# EAGLE design ASD2116 (EAGLE 6.3)
DATABASE: ./../../../../../Components/TinyCircuits_Part_Database.txt
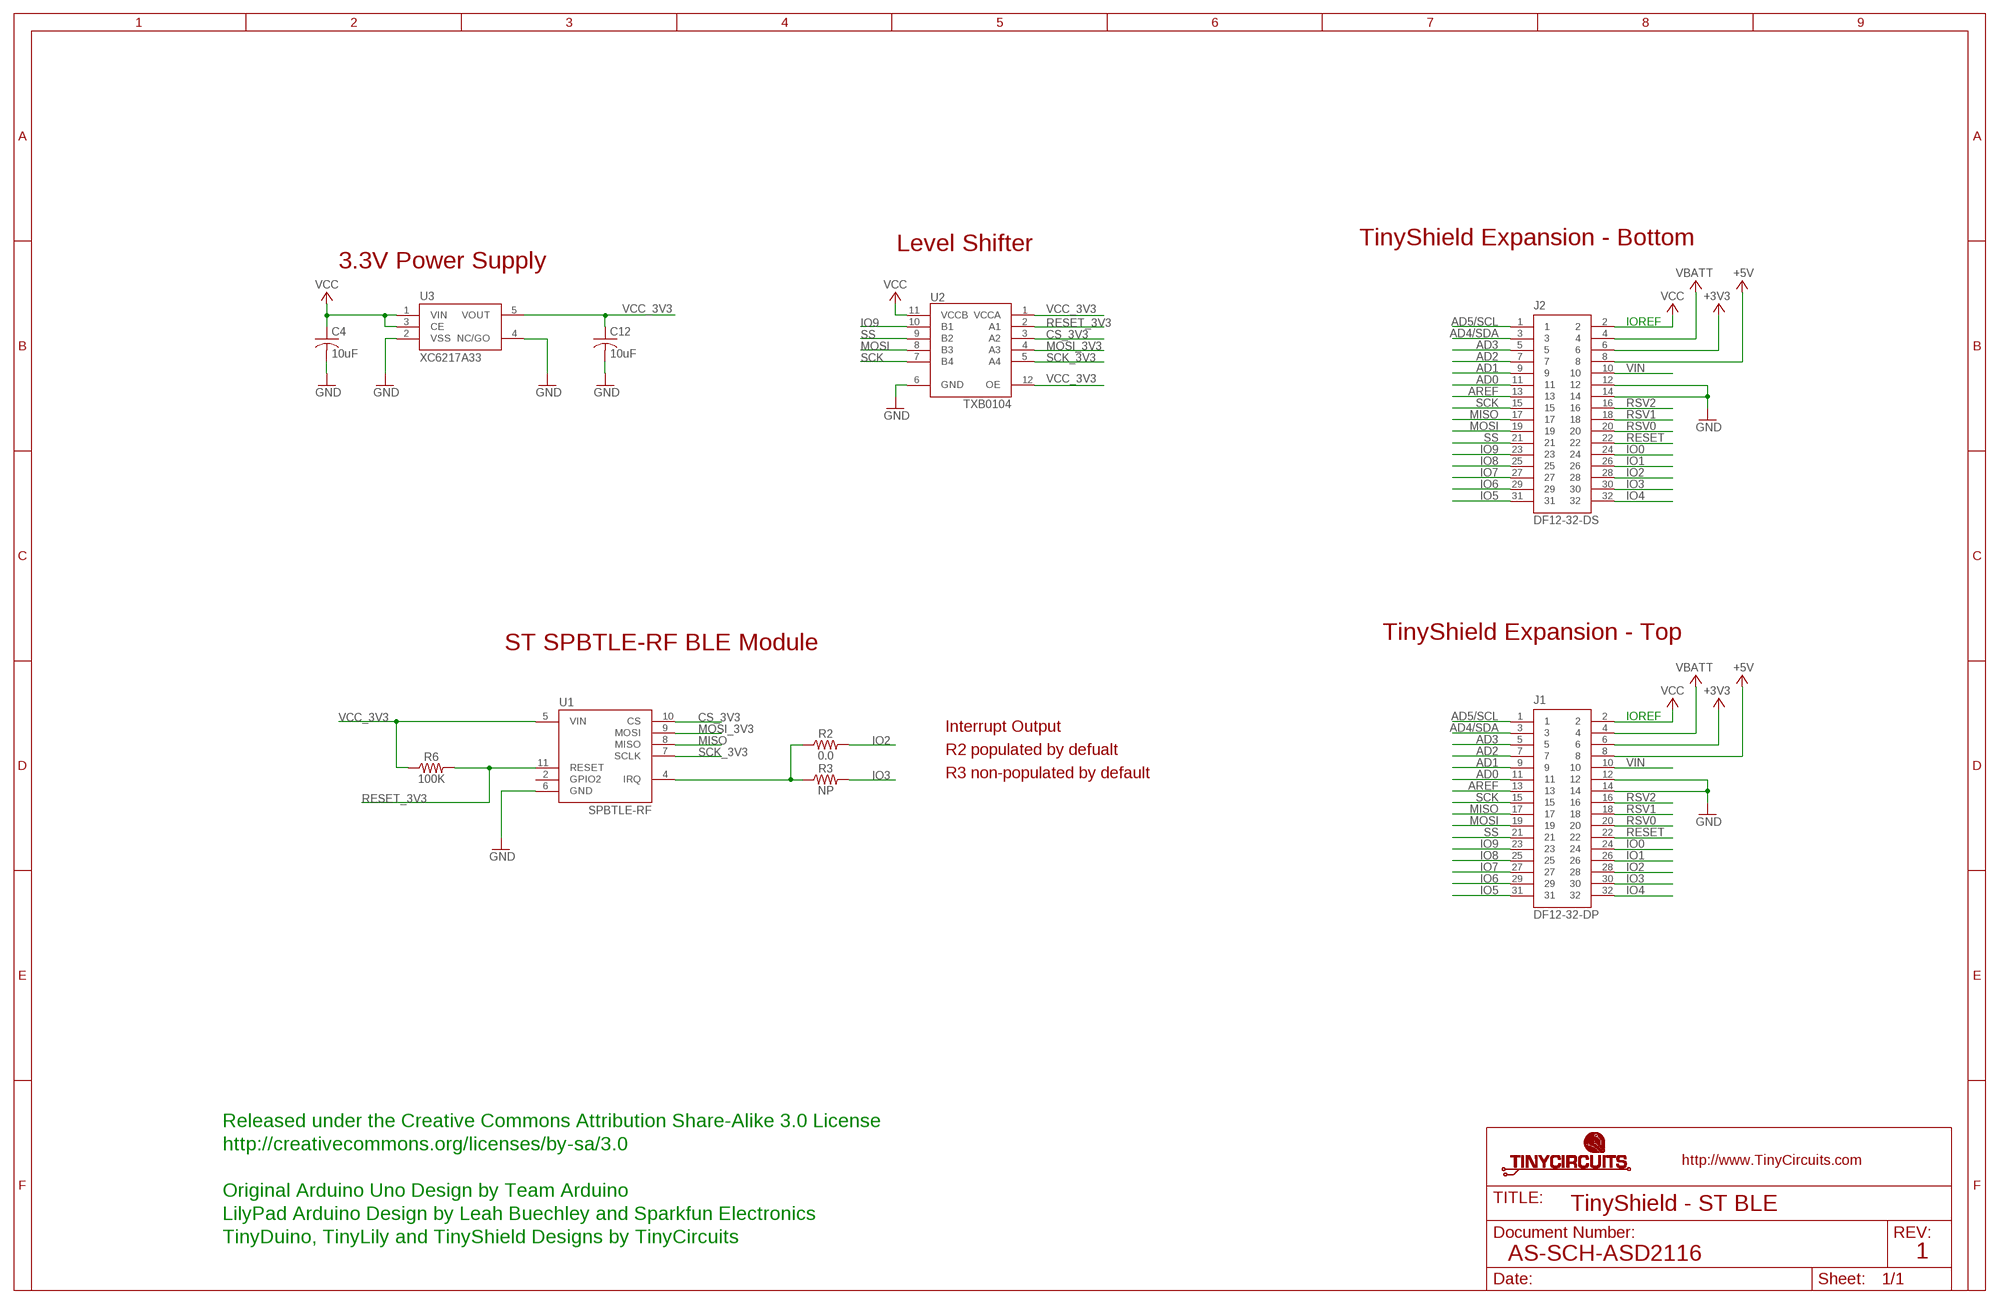
[diagram p0: schematic, sheet 1]

## Parts
C4  10uF  AS-ITM-00002  [C0603]
C12  10uF  AS-ITM-00002  [C0603]
J1  DF12-32-DP  AS-ITM-00015  [DF12-32-DP]
J2  DF12-32-DS  AS-ITM-00012  [DF12-32-DS]
R2  0.0  AS-ITM-00076  [0402]
R3  NP  AS-ITM-00076  [0402]
R6  100K  AS-ITM-00004  [0402]
U1  SPBTLE-RF  AS-ITM-00294  [SPBTLE-RF]
U2  TXB0104  AS-ITM-00048  [UQFN-12]
U3  XC6217A33  AS-ITM-00249  [SOT-25]

## Nets
+3V3: J1.6 J2.6
+5V: J1.8 J2.8
AD0: J1.11 J2.11
AD1: J1.9 J2.9
AD2: J1.7 J2.7
AD3: J1.5 J2.5
AD4/SDA: J1.3 J2.3
AD5/SCL: J1.1 J2.1
AREF: J1.13 J2.13
CS_3V3: U1.10(CS) U2.3(A2)
GND: C4.2 C12.2 J1.12 J1.14 J2.12 J2.14 U1.6(GND) U2.6(GND) U3.2(VSS) U3.4(NC/GO)
IO0: J1.24 J2.24
IO1: J1.26 J2.26
IO2: J1.28 J2.28 R2.2
IO3: J1.30 J2.30 R3.2
IO4: J1.32 J2.32
IO5: J1.31 J2.31
IO6: J1.29 J2.29
IO7: J1.27 J2.27
IO8: J1.25 J2.25
IO9: J1.23 J2.23 U2.10(B1)
IRQ: R2.1 R3.1 U1.4(IRQ)
MISO: J1.17 J2.17 U1.8(MISO)
MOSI: J1.19 J2.19 U2.8(B3)
MOSI_3V3: U1.9(MOSI) U2.4(A3)
RESET: J1.22 J2.22
RESET_3V3: R6.2 U1.11(RESET) U2.2(A1)
RSV0: J1.20 J2.20
RSV1: J1.18 J2.18
RSV2: J1.16 J2.16
SCK: J1.15 J2.15 U2.7(B4)
SCK_3V3: U1.7(SCLK) U2.5(A4)
SS: J1.21 J2.21 U2.9(B2)
VBATT: J1.4 J2.4
VCC: C4.1 J1.2 J2.2 U2.11(VCCB) U3.1(VIN) U3.3(CE)
VCC_3V3: C12.1 R6.1 U1.5(VIN) U2.1(VCCA) U2.12(OE) U3.5(VOUT)
VIN: J1.10 J2.10
Unconnected: U1.2(GPIO2)

## Notes on the sheet
- Level Shifter | TinyShield Expansion - Bottom
- 3.3V Power Supply
- IOREF
- TinyShield Expansion - Top
- ST SPBTLE-RF BLE Module
- IOREF
- Interrupt Output
- R2 populated by defualt
- R3 non-populated by default
- Released under the Creative Commons Attribution Share-Alike 3.0 License
- http://creativecommons.org/licenses/by-sa/3.0
- Original Arduino Uno Design by Team Arduino
- TinyShield - ST BLE
- LilyPad Arduino Design by Leah Buechley and Sparkfun Electronics
- TinyDuino, TinyLily and TinyShield Designs by TinyCircuits
- AS-SCH-ASD2116 | 1

## Library data of the parts
C4 C12 = tinycircuits:AS-ITM-00002: CAP CER 10UF 10V 20% X5R 0603; PARTNO: AS-ITM-00002
J1 = tinycircuits:AS-ITM-00015: CONN HEADER 32POS 3MM SMD 0.5MM; PARTNO: AS-ITM-00015
J2 = tinycircuits:AS-ITM-00012: CONN RECEPT 32POS 3MM SMD 0.5MM; PARTNO: AS-ITM-00012
R2 = tinycircuits:AS-ITM-00076: RES 0.0 OHM 1/16W 1% 0402 SMD; PARTNO: AS-ITM-00076
R3 = tinycircuits:AS-ITM-00076: RES 0.0 OHM 1/16W 1% 0402 SMD; PARTNO: AS-ITM-00076; VALUE: 0.0
R6 = tinycircuits:AS-ITM-00004: RES 100K OHM 1/16W 1% 0402; PARTNO: AS-ITM-00004
U1 = tinycircuits:AS-ITM-00294: MODULE BLE; PARTNO: AS-ITM-00294
U2 = tinycircuits:AS-ITM-00048: IC VOLT-LEVEL TRANSLATOR 12UQFN; PARTNO: AS-ITM-00048
U3 = tinycircuits:AS-ITM-00249: IC REG LDO 3.3V 0.2A SOT25; PARTNO: AS-ITM-00249

## Board
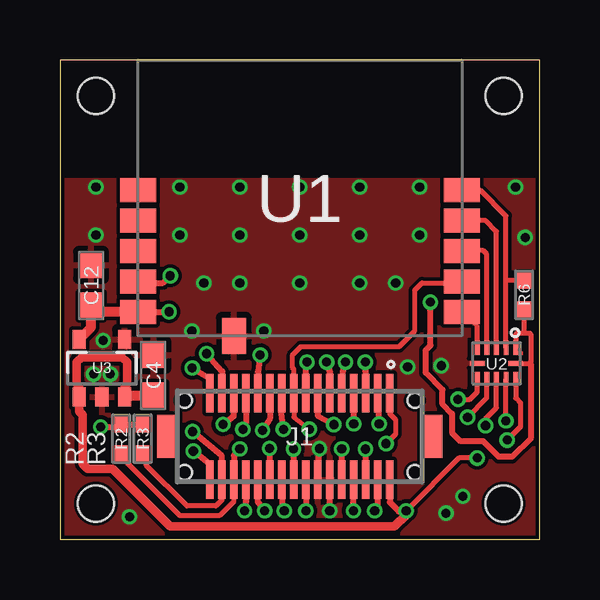
[diagram p1: board, top side]
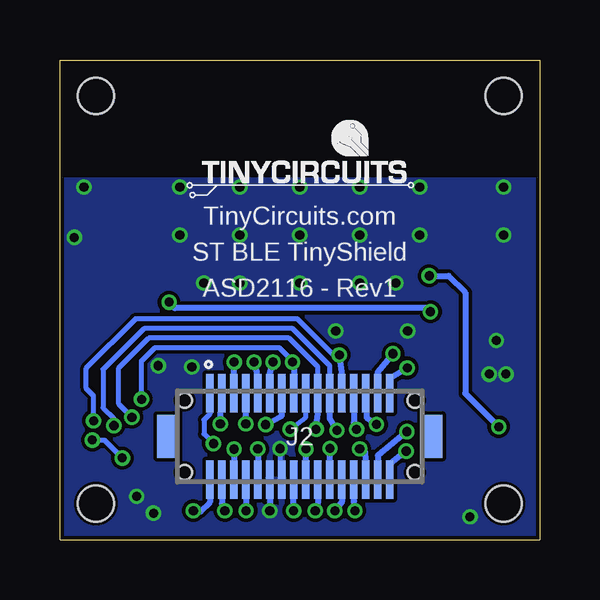
[diagram p2: board, bottom side, seen from below]

Size 20 x 20 mm. Coordinates in mm from the lower left corner, seen from the top.
Outline: 20,0 0,0 0,20 20,20 20,0
Copper layers (1*16): Top 0.035mm / dielectric 1.5mm / Bottom 0.035mm
Design rules "default *": minimum track width 7mil, minimum drill 15mil, track to track 6mil, track to pad 6mil, pad to pad 6mil, via to via 6mil, smd to smd 6mil, copper to edge 6mil, drill to drill 8mil, minimum pad ring 10mil, minimum via ring 5mil, stop-mask expansion 4mil, vias tented up to drill 25mil, thermal gap 10mil
Holes 1.5 mm at 1.5,18.5 18.5,18.5 18.5,1.5 1.5,1.5
tRestrict: 1 lines
bRestrict: 1 lines

### Footprints (pad centres in the part's own frame; a part is rotated, then mirrored left to right if it is on the bottom)
C0603 = smd 1.1 x 1: 1 -0.85,0; 2 0.85,0
DF12-32-DP = smd 0.3 x 1.6: 1 -3.75,-1.8; 2 -3.75,1.8; 3 -3.25,-1.8; 4 -3.25,1.8; 5 -2.75,-1.8; 6 -2.75,1.8; 7 -2.25,-1.8; 8 -2.25,1.8; 9 -1.75,-1.8; 10 -1.75,1.8; 11 -1.25,-1.8; 12 -1.25,1.8; 13 -0.75,-1.8; 14 -0.75,1.8; 15 -0.25,-1.8; 16 -0.25,1.8; 17 0.25,-1.8; 18 0.25,1.8; 19 0.75,-1.8; 20 0.75,1.8; 21 1.25,-1.8; 22 1.25,1.8; 23 1.75,-1.8; 24 1.75,1.8; 25 2.25,-1.8; 26 2.25,1.8; 27 2.75,-1.8; 28 2.75,1.8; 29 3.25,-1.8; 30 3.25,1.8; 31 3.75,-1.8; 32 3.75,1.8 | smd 0.9 x 1.8: F1 -5.5,0; F2 5.5,0 | hole 0.6: -4.8,1.5; 4.8,1.5
DF12-32-DS = smd 0.3 x 1.6: 1 -3.75,1.8; 2 -3.75,-1.8; 3 -3.25,1.8; 4 -3.25,-1.8; 5 -2.75,1.8; 6 -2.75,-1.8; 7 -2.25,1.8; 8 -2.25,-1.8; 9 -1.75,1.8; 10 -1.75,-1.8; 11 -1.25,1.8; 12 -1.25,-1.8; 13 -0.75,1.8; 14 -0.75,-1.8; 15 -0.25,1.8; 16 -0.25,-1.8; 17 0.25,1.8; 18 0.25,-1.8; 19 0.75,1.8; 20 0.75,-1.8; 21 1.25,1.8; 22 1.25,-1.8; 23 1.75,1.8; 24 1.75,-1.8; 25 2.25,1.8; 26 2.25,-1.8; 27 2.75,1.8; 28 2.75,-1.8; 29 3.25,1.8; 30 3.25,-1.8; 31 3.75,1.8; 32 3.75,-1.8 | smd 0.9 x 1.8: F1 -5.5,0; F2 5.5,0 | hole 0.6: -4.8,1.5; 4.8,1.5
0402 = smd 0.65 x 0.55: 1 -0.6,0; 2 0.6,0
SPBTLE-RF = smd 1.5 x 1: 1 -6.75,0.33; 2 -6.75,-0.94; 3 -6.75,-2.21; 4 -6.75,-3.48; 5 -6.75,-4.75; 7 6.75,-4.75; 8 6.75,-3.48; 9 6.75,-2.21; 10 6.75,-0.94; 11 6.75,0.33 | smd 1 x 1.5: 6 -2.75,-5.75
UQFN-12 = smd 0.2 x 0.6: 1 -0.8,-0.65; 2 -0.4,-0.65; 3 0,-0.65; 4 0.4,-0.65; 5 0.8,-0.65; 7 0.8,0.65; 8 0.4,0.65; 9 0,0.65; 10 -0.4,0.65; 11 -0.8,0.65 | smd 0.6 x 0.2: 6 0.8,0; 12 -0.8,0
SOT-25 = smd 0.55 x 0.8: 1 -0.95,-1.2; 2 0,-1.2; 3 0.95,-1.2; 4 0.95,1.2; 5 -0.95,1.2

### Placement (x,y rotation side)
C4  3.9,6.85 90 top
C12  1.3,10.6 90 top
J1  10,4.3 180 top
J2  10,4.3 0 bottom
R2  2.55,4.2 270 top
R3  3.45,4.2 270 top
R6  19.35,10.2 90 top
U1  10,14.25 0 top
U2  18.2,7.35 180 top
U3  1.75,7.15 0 top
U$1  [DOCFIELD-TINYCIRCUITS-PCB]  33.91,-10 0 top  (outside the outline)

### Tracks (layer width: path | path; a pad name or v marks a point on that pad's centre or on a via)
+3V3  (via drill 0.38)
  Top 0.254: J2.6 v12.75,3.77 v12.74,3.77
  Bottom 0.254: v12.74,3.77 12.74,2.51 J2.6
+5V  (via drill 0.38)
  Top 0.254: v12.24,1.2 J2.8
  Bottom 0.254: J2.8 12.25,1.21 v12.24,1.2
AD0  (via drill 0.38)
  Top 0.254: v11.12,7.4 11.25,6.95 J2.11
  Bottom 0.254: J2.11 11.25,6.95 v11.12,7.4
AD1  (via drill 0.38)
  Top 0.254: J2.9 11.79,7 v11.91,7.4
  Bottom 0.254: v11.91,7.4 11.78,7 J2.9
AD2  (via drill 0.38)
  Top 0.254: v12.25,4.83 J2.7
  Bottom 0.254: v12.25,4.83 J2.7
AD3  (via drill 0.38)
  Top 0.254: v12.73,7.4 12.73,7.02 J2.5
  Bottom 0.254: J2.5 12.75,6.98 v12.73,7.4
AD4/SDA  (via drill 0.38)
  Top 0.254: v13.31,4.83 13.31,5 J2.3
  Bottom 0.254: J2.3 13.28,5.86 v13.31,4.83
AD5/SCL  (via drill 0.38)
  Top 0.203: v13.6,4 14,4.4 14,5 13.75,5.25 J2.1
  Bottom 0.203: J2.1 13.75,5.25 14,5 14,4.4 v13.6,4
AREF  (via drill 0.38)
  Top 0.254: J2.13 10.77,5.14 v11.42,4.79
  Bottom 0.254: v11.42,4.79 10.77,5.14 J2.13
CS_3V3
  Top 0.203: U2.3 18.2,12.85 17.75,13.3 U1.10
GND  (via drill 0.38)
  Top 0.203: 11.25,2.46 J1.12 | v10.83,3.79 10.75,3.54 J1.14 v10.83,3.79
  Top 0.254: v11.25,1.2 11.25,2.46
  Bottom 0.203: J1.14 v10.83,3.79 | 11.25,1.13 v11.25,1.2
  Bottom 0.254: J1.12 11.25,1.13
  other vias: 10,14.7 19.4,12.6 16.8,1.8 16.1,1.1 2.9,0.95 15.9,7.25 7.5,14.7 5,14.7 12.5,14.7 15,14.7 15,12.7 12.5,12.7 10,12.7 7.5,12.7 5,12.7 6,10.7 7.5,10.7 10,10.7 12.5,10.7 14,10.7 1.5,14.7 1.5,12.7 19,14.7 5.5,8.7 8.5,8.7 14.5,7.2 1.4,6.9 2.1,6.9 1.8,8.3
  pour Top: 0,20 20,20 20,0 0,0
  pour Bottom: 0,20 20,20 20,0 0,0
IO0  (via drill 0.38)
  Top 0.254: v8.54,1.2 8.25,1.56 J2.24
  Bottom 0.254: J2.24 8.25,1.56 v8.54,1.2
IO1  (via drill 0.38)
  Top 0.254: J2.26 7.75,1.63 v7.7,1.2
  Bottom 0.203: 7.73,2.48 J2.26
  Bottom 0.254: v7.7,1.2 7.73,1.61 7.73,2.48
IO2  (via drill 0.38)
  Top 0.203: J2.28 7.25,1.6 6.65,1 5,1 2.7,3.3 2.7,3.45 R2.2
  Top 0.254: v7.5,3.78 7.33,3.66 7.25,3.49 7.25,2.61 7.26,2.51 J2.28
  Bottom 0.254: J2.28 7.24,3.43 7.28,3.65 v7.5,3.78
IO3  (via drill 0.38)
  Top 0.203: J2.30 6.75,1.65 6.5,1.4 5.3,1.4 3.6,3.1 3.6,3.45 R3.2
  Top 0.254: J2.30 6.75,3.49 v5.53,4.5
  Bottom 0.254: v5.53,4.5 6.75,3.51 6.77,2.53 J2.30
IO4  (via drill 0.38)
  Top 0.254: J2.32 6.25,3.14 v5.56,3.69
  Bottom 0.254: v5.56,3.69 5.61,3.65 6.21,3.18 6.21,3.14 6.26,3.1 J2.32
IO5  (via drill 0.38)
  Top 0.254: v5.52,7.16 6.23,6.73 J2.31
  Bottom 0.254: J2.31 6.26,6.69 v5.52,7.16
IO6  (via drill 0.38)
  Top 0.254: J2.29 6.76,7.01 v6.11,7.75
  Bottom 0.254: J2.29 6.75,6.98 v6.11,7.75
IO7  (via drill 0.38)
  Top 0.254: v6.8,4.8 7.26,5.15 J2.27
  Bottom 0.254: J2.27 7.19,5.06 v6.8,4.8
IO8  (via drill 0.38)
  Top 0.203: 7.78,6.13 J2.25
  Top 0.254: J2.25 7.75,4.87 v7.63,4.6
  Bottom 0.254: J2.25 7.75,4.87 v7.63,4.6
IO9  (via drill 0.38)
  Top 0.203: v18.6,4.95 U2.10
  Top 0.254: v8.35,7.7 8.25,7 J2.23
  Bottom 0.203: v8.35,7.7 8.6,7.7 10.1,9.2 16.85,9.2 18.9,7.15 18.9,6.3 18.6,6 v18.6,4.95
  Bottom 0.254: J2.23 8.25,7 v8.35,7.7
IRQ  (via drill 0.38)
  Top 0.203: 3.32,10.7 U1.4
  Top 0.254: 3.32,10.7 4.3,10.7 v4.6,11 | v1.7,4.7 2.45,4.7 R2.1 R3.1
  Bottom 0.254: v4.6,11 3.8,11 3.1,10.3 3.1,6.1 v1.7,4.7
MISO  (via drill 0.38)
  Top 0.203: 9.74,6.11 J2.17 | J2.17 9.75,5.1 v10.4,4.6 | J2.17 9.75,7.1 9.7,7.15 9.7,7.7 10.05,8.05 14.15,8.05 14.8,8.7 14.8,10.4 15.1,10.7 16.73,10.7 U1.8
  Bottom 0.203: v10.4,4.6 9.75,5.1 J2.17
MOSI  (via drill 0.38)
  Top 0.203: v17,5.1 17.8,5.9 U2.8
  Top 0.254: v9.32,4.6 9.23,5.26 J2.19
  Bottom 0.203: J2.19 9.25,7.2 10.45,8.4 16.3,8.4 17.55,7.15 17.55,5.65 v17,5.1
  Bottom 0.254: J2.19 9.25,5.26 v9.32,4.6
MOSI_3V3
  Top 0.203: U2.4 17.8,11.9 17.65,12.05 U1.9
RESET  (via drill 0.38)
  Top 0.254: v8.74,3.8 J2.22
  Bottom 0.254: J2.22 8.75,3.69 v8.74,3.8
RESET_3V3
  Top 0.203: U2.2 18.6,10.8 | 18.6,10.8 18.6,13.5 17.55,14.55 16.78,14.55 U1.11 | R6.2 18.6,10.8
RSV0  (via drill 0.38)
  Top 0.254: J2.20 9.25,1.2 v9.36,1.2
  Bottom 0.254: J2.20 9.25,1.84 9.25,1.2 v9.36,1.2
RSV1  (via drill 0.38)
  Top 0.254: v9.74,3.77 9.74,2.51 J2.18
  Bottom 0.254: J2.18 9.75,3.72 v9.74,3.77
RSV2  (via drill 0.38)
  Top 0.254: J2.16 10.25,1.16 v10.25,1.2
  Bottom 0.254: v10.25,1.2 J2.16
SCK  (via drill 0.38)
  Top 0.203: v16.6,5.85 17.1,5.85 17.4,6.15 U2.7
  Top 0.254: J2.15 10.25,7.15 v10.3,7.4
  Bottom 0.203: v10.3,7.4 10.3,7.45 10.85,8 16.05,8 16.6,7.45 v16.6,5.85
  Bottom 0.254: v10.3,7.4 10.25,7.15 J2.15
SCK_3V3
  Top 0.203: U2.5 17.4,8.9 U1.7
SS  (via drill 0.38)
  Top 0.203: v17.75,4.75 17.75,5.05 18.2,5.5 U2.9
  Top 0.254: J2.21 8.75,5.05 v8.45,4.55
  Bottom 0.203: 8.35,4.6 v8.45,4.55 | J2.21 8.75,7.25 10.3,8.8 16.5,8.8 18.2,7.1 18.2,5.5 17.75,5.05 v17.75,4.75
  Bottom 0.254: v8.45,4.55 8.75,5.05 J2.21
VBATT  (via drill 0.38)
  Top 0.254: v13.13,1.2 13.25,1.48 J2.4
  Bottom 0.254: J2.4 13.25,1.5 v13.13,1.2
VCC  (via drill 0.38)
  Top 0.2: v14.44,1.2 14.47,1.15
  Top 0.203: U2.11 19,5.9 19.2,5.7 19.2,4.7 v18.65,4.15 | v17.4,3.4 16.64,3.4 v14.44,1.2
  Top 0.254: J2.2 13.75,1.56 14.13,1.18 14.38,1.18 v14.44,1.2
  Top 0.356: v14.44,1.2 14.44,1.04 13.95,0.55 4.6,0.55 2.2,2.95 1.15,2.95 0.95,3.15 0.95,5.2 0.8,5.35 U3.1 0.8,6.4 0.7,6.5 0.7,7.4 0.9,7.6 2.6,7.6 2.8,7.4 2.8,6.5 2.7,6.4 U3.3
  Top 0.406: C4.1 2.75,6 U3.3
  Bottom 0.203: v18.65,4.15 18.15,4.15 v17.4,3.4
  Bottom 0.254: v14.44,1.2 14.38,1.18 14.13,1.18 13.75,1.56 J2.2
VCC_3V3  (via drill 0.38)
  Top 0.203: U2.12 19.6,7.35 19.65,7.4 19.65,8.55 19.6,8.6 19.35,8.6 | 19.35,8.6 19.05,8.6 19,8.55 U2.1 | R6.1 19.35,8.6
  Top 0.254: U1.5 v4.55,9.5 | 19.6,7.35 19.65,7.3 19.65,4.25 18.85,3.45 18.3,3.45 17.65,4.1 16.7,4.1 16.35,4.45 16.35,5.25 15.95,5.65 15.95,6.25 15.25,6.95 15.25,7.9 15.45,8.1 v15.45,9.9
  Top 0.406: U3.5 1.3,8.85 C12.1 1.55,9.5 U1.5
  Bottom 0.254: v4.55,9.5 4.7,9.65 15.2,9.65 v15.45,9.9
VIN  (via drill 0.38)
  Top 0.254: J2.10 v11.76,3.78 v11.75,3.78
  Bottom 0.254: v11.75,3.78 J2.10

### Text on the board
tPlace: R2 | R3
bPlace: TinyCircuits.com | ST BLE TinyShield | ASD2116 - Rev1
Document: FABRICATION DRAWING | NOTES: | 1. PRINTED CIRCUIT BOARD MADE FROM NEMA GRADE FR-4 EPOXY LAMINATE | WITH 1 OUNCE COPPER PLATING AND .024 THICKNESS. | 2. ALL DIMENSIONS ARE GIVEN IN INCHES. | 3. CIRCUIT PATHS ARE FOR REFERENCE ONLY. | 4. HOLE SIZES SHOWN ARE FINISHED DIAMETERS AFTER PLATING. | 5. BOARD PLATED USING REFLOW OR SIMILAR METHOD. | 6. BOARD TO HAVE BLUE SOLDER MASK ON PLATED SURFACES USING WET FILM | 7. SILKSCREEN BOARD USING WHITE INK. | SR100 OR SR1010 EPOXY. EQUIVALENT WET OR DRY FILM MAY BE USED. | 8. THE FOLLOWING INFORMATION APPLIES TO THIS BOARD: | * 2 COPPER LAYERS | * .024 BOARD THICKNESS | * REQUIRES TOP SIDE SILKSCREEN | Released under the Creative Commons Attribution Share-Alike 3.0 License | http://creativecommons.org/licenses/by-sa/3.0 | Original Arduino Uno Design by Team Arduino | LilyPad Arduino Design by Leah Buechley and Sparkfun Electronics | TinyDuino, TinyLily and TinyShield Designs by TinyCircuits | TinyShield - ST BLE | AS-PCB-ASD2116 | 1